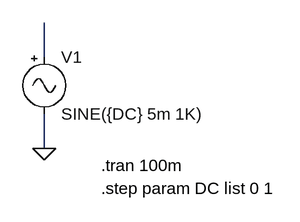
[diagram p0: schematic Compression.asc]
Compression.asc, the LTspice schematic file:
Version 4
SHEET 1 880 680
WIRE 128 256 128 208
WIRE 128 384 128 336
FLAG 128 384 0
SYMBOL misc\\signal 128 240 R0
SYMATTR InstName V1
SYMATTR Value SINE({DC} 5m 1K)
TEXT 208 408 Left 0 !.tran 100m
TEXT 208 440 Left 0 !.step param DC list 0 1

The netlist it stands for:
* Compression.asc
V1 N001 0 SINE({DC} 5m 1K)
.tran 100m
.step param DC list 0 1
.backanno
.end